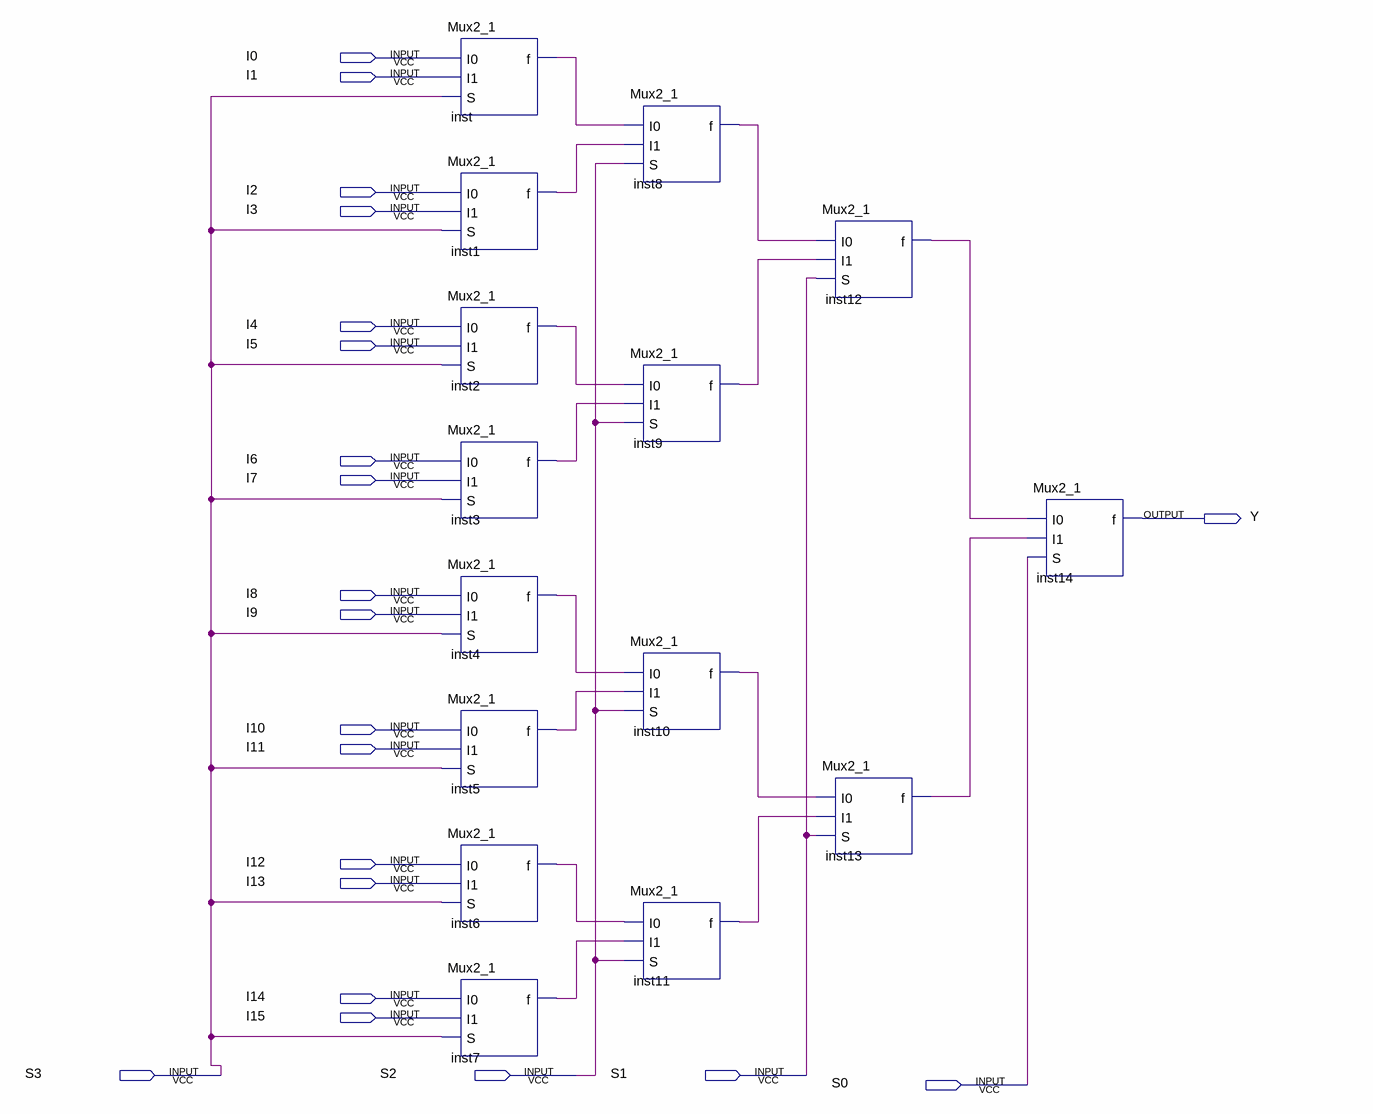
[diagram p0: schematic sheet]
// Quartus schematic Mux16_1.bdf as structural Verilog: 15 symbols, 21 pins
module Mux16_1 (
  input  I0,
  input  I1,
  input  I2,
  input  I3,
  input  I4,
  input  I5,
  input  I6,
  input  I7,
  input  I8,
  input  I9,
  input  I10,
  input  I11,
  input  I12,
  input  I13,
  input  I14,
  input  I15,
  input  S3,
  input  S2,
  input  S1,
  input  S0,
  output Y
);

  wire inst1_f, inst2_f, inst3_f, inst4_f, inst5_f, inst6_f, inst7_f, inst8_f, inst9_f, inst10_f, inst11_f,
       inst12_f, inst13_f, inst_f;

  Mux2_1 inst (.I0(I0), .I1(I1), .S(S3), .f(inst_f));
  Mux2_1 inst1 (.I0(I2), .I1(I3), .S(S3), .f(inst1_f));
  Mux2_1 inst2 (.I0(I4), .I1(I5), .S(S3), .f(inst2_f));
  Mux2_1 inst3 (.I0(I6), .I1(I7), .S(S3), .f(inst3_f));
  Mux2_1 inst4 (.I0(I8), .I1(I9), .S(S3), .f(inst4_f));
  Mux2_1 inst5 (.I0(I10), .I1(I11), .S(S3), .f(inst5_f));
  Mux2_1 inst6 (.I0(I12), .I1(I13), .S(S3), .f(inst6_f));
  Mux2_1 inst7 (.I0(I14), .I1(I15), .S(S3), .f(inst7_f));
  Mux2_1 inst8 (.I0(inst_f), .I1(inst1_f), .S(S2), .f(inst8_f));
  Mux2_1 inst9 (.I0(inst2_f), .I1(inst3_f), .S(S2), .f(inst9_f));
  Mux2_1 inst10 (.I0(inst4_f), .I1(inst5_f), .S(S2), .f(inst10_f));
  Mux2_1 inst11 (.I0(inst6_f), .I1(inst7_f), .S(S2), .f(inst11_f));
  Mux2_1 inst12 (.I0(inst8_f), .I1(inst9_f), .S(S1), .f(inst12_f));
  Mux2_1 inst13 (.I0(inst10_f), .I1(inst11_f), .S(S1), .f(inst13_f));
  Mux2_1 inst14 (.I0(inst12_f), .I1(inst13_f), .S(S0), .f(Y));
endmodule
